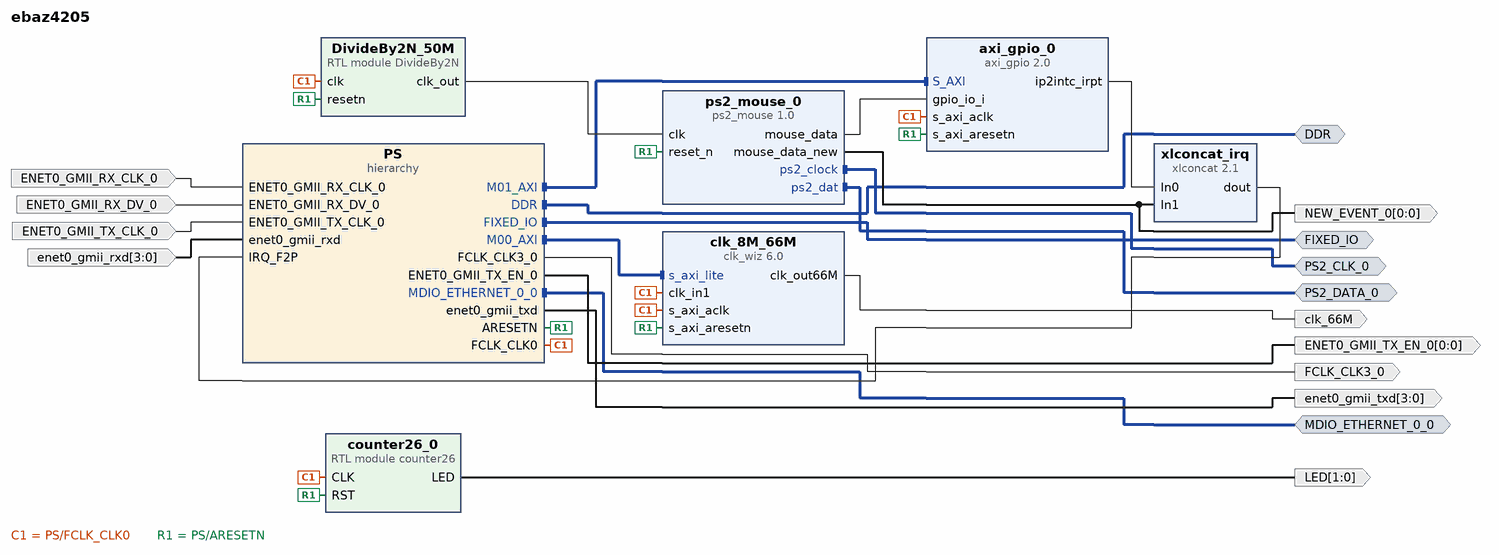
[diagram p0: block diagram of the top level]
# Vivado block design ebaz4205, xc7z010clg400-1, Vivado 2021.2
create_bd_design ebaz4205

create_bd_intf_port -mode Master -vlnv xilinx.com:interface:ddrx_rtl:1.0 DDR
create_bd_intf_port -mode Master -vlnv xilinx.com:display_processing_system7:fixedio_rtl:1.0 FIXED_IO
create_bd_intf_port -mode Master -vlnv xilinx.com:interface:mdio_rtl:1.0 MDIO_ETHERNET_0_0
create_bd_intf_port -mode Master -vlnv xilinx.com:interface:gpio_rtl:1.0 PS2_CLK_0
create_bd_intf_port -mode Master -vlnv xilinx.com:interface:gpio_rtl:1.0 PS2_DATA_0
create_bd_port -dir I -type clk ENET0_GMII_RX_CLK_0
create_bd_port -dir I ENET0_GMII_RX_DV_0
create_bd_port -dir I -type clk ENET0_GMII_TX_CLK_0
create_bd_port -dir O -from 0 -to 0 ENET0_GMII_TX_EN_0
create_bd_port -dir O -from 1 -to 0 LED
create_bd_port -dir I -from 3 -to 0 enet0_gmii_rxd
create_bd_port -dir O -from 3 -to 0 enet0_gmii_txd
create_bd_port -dir O -type clk clk_66M
set_property -dict {CONFIG.FREQ_HZ 66666666} [get_bd_ports clk_66M]
create_bd_port -dir O -type clk FCLK_CLK3_0
set_property -dict {CONFIG.FREQ_HZ 25000000} [get_bd_ports FCLK_CLK3_0]
create_bd_port -dir O -from 0 -to 0 NEW_EVENT_0

create_bd_cell -type ip -vlnv xilinx.com:ip:clk_wiz:6.0 clk_8M_66M
set_property -dict [list \
  CONFIG.CLKIN1_JITTER_PS 100.0 \
  CONFIG.CLKOUT1_JITTER 142.508 \
  CONFIG.CLKOUT1_PHASE_ERROR 98.575 \
  CONFIG.CLKOUT1_REQUESTED_OUT_FREQ 66.66667 \
  CONFIG.CLKOUT2_JITTER 178.370 \
  CONFIG.CLKOUT2_PHASE_ERROR 164.985 \
  CONFIG.CLKOUT2_REQUESTED_OUT_FREQ 66.66667 \
  CONFIG.CLKOUT2_USED false \
  CONFIG.CLK_OUT1_PORT clk_out66M \
  CONFIG.CLK_OUT2_PORT clk_out66M \
  CONFIG.MMCM_CLKFBOUT_MULT_F 10.000 \
  CONFIG.MMCM_CLKIN1_PERIOD 10.000 \
  CONFIG.MMCM_CLKIN2_PERIOD 10.000 \
  CONFIG.MMCM_CLKOUT0_DIVIDE_F 15.000 \
  CONFIG.MMCM_CLKOUT1_DIVIDE 1 \
  CONFIG.NUM_OUT_CLKS 1 \
  CONFIG.PRIM_IN_FREQ 100.000 \
  CONFIG.USE_DYN_RECONFIG true \
] [get_bd_cells clk_8M_66M]
create_bd_cell -type hier PS
create_bd_cell -type module -reference DivideBy2N DivideBy2N_50M
set_property -dict {CONFIG.N 1 CONFIG.WIDTH 1} [get_bd_cells DivideBy2N_50M]
create_bd_cell -type module -reference counter26 counter26_0
set_property -dict {CONFIG.LED_COUNTER_1SEC 0x06FFFFFF CONFIG.THRESHOLD 0x00002710} [get_bd_cells counter26_0]
create_bd_cell -type ip -vlnv xilinx.com:ip:axi_gpio:2.0 axi_gpio_0
set_property -dict {CONFIG.C_ALL_INPUTS 1 CONFIG.C_INTERRUPT_PRESENT 1} [get_bd_cells axi_gpio_0]
create_bd_cell -type ip -vlnv xilinx.com:ip:xlconcat:2.1 xlconcat_irq
create_bd_cell -type ip -vlnv xilinx.com:user:ps2_mouse:1.0 ps2_mouse_0

# ---- hierarchy /PS ----
current_bd_instance /PS
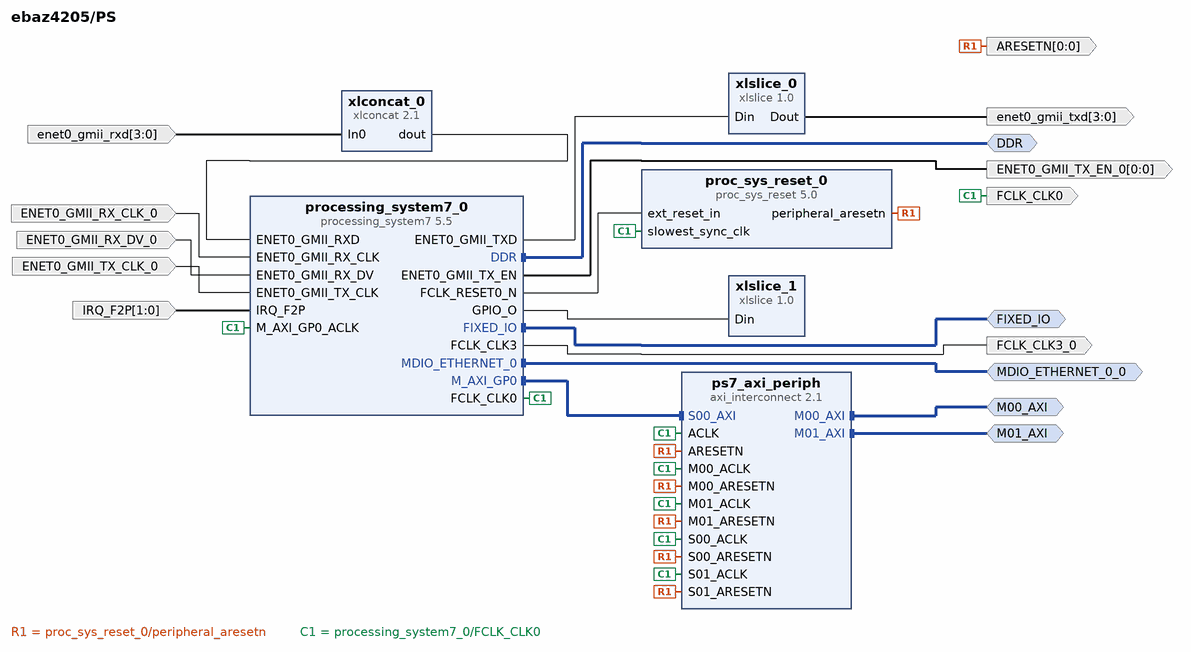
[diagram p1: block diagram inside /PS]
create_bd_intf_pin -mode Master -vlnv xilinx.com:interface:mdio_rtl:1.0 MDIO_ETHERNET_0_0
create_bd_intf_pin -mode Master -vlnv xilinx.com:interface:ddrx_rtl:1.0 DDR
create_bd_intf_pin -mode Master -vlnv xilinx.com:display_processing_system7:fixedio_rtl:1.0 FIXED_IO
create_bd_intf_pin -mode Master -vlnv xilinx.com:interface:aximm_rtl:1.0 M00_AXI
create_bd_intf_pin -mode Master -vlnv xilinx.com:interface:aximm_rtl:1.0 M01_AXI
create_bd_pin -dir O -from 0 -to 0 ENET0_GMII_TX_EN_0
create_bd_pin -dir I -type clk ENET0_GMII_RX_CLK_0
create_bd_pin -dir I ENET0_GMII_RX_DV_0
create_bd_pin -dir I -type clk ENET0_GMII_TX_CLK_0
create_bd_pin -dir O -type clk FCLK_CLK0
create_bd_pin -dir O -type clk FCLK_CLK3_0
create_bd_pin -dir O -from 3 -to 0 enet0_gmii_txd
create_bd_pin -dir O -from 0 -to 0 -type rst ARESETN
create_bd_pin -dir I -from 3 -to 0 enet0_gmii_rxd
create_bd_pin -dir I -from 1 -to 0 -type intr IRQ_F2P

create_bd_cell -type ip -vlnv xilinx.com:ip:xlslice:1.0 xlslice_0
set_property -dict {CONFIG.DIN_FROM 3 CONFIG.DIN_TO 0 CONFIG.DIN_WIDTH 8 CONFIG.DOUT_WIDTH 4} [get_bd_cells xlslice_0]
create_bd_cell -type ip -vlnv xilinx.com:ip:xlslice:1.0 xlslice_1
set_property -dict {CONFIG.DIN_FROM 1 CONFIG.DIN_WIDTH 64 CONFIG.DOUT_WIDTH 2} [get_bd_cells xlslice_1]
create_bd_cell -type ip -vlnv xilinx.com:ip:proc_sys_reset:5.0 proc_sys_reset_0
create_bd_cell -type ip -vlnv xilinx.com:ip:processing_system7:5.5 processing_system7_0
set_property -dict [list \
  CONFIG.PCW_ENET0_ENET0_IO EMIO \
  CONFIG.PCW_ENET0_GRP_MDIO_ENABLE 1 \
  CONFIG.PCW_ENET0_GRP_MDIO_IO EMIO \
  CONFIG.PCW_ENET0_PERIPHERAL_ENABLE 1 \
  CONFIG.PCW_ENET0_PERIPHERAL_FREQMHZ {100 Mbps} \
  CONFIG.PCW_ENET0_RESET_ENABLE 0 \
  CONFIG.PCW_ENET_RESET_ENABLE 1 \
  CONFIG.PCW_ENET_RESET_SELECT {Share reset pin} \
  CONFIG.PCW_EN_CLK3_PORT 1 \
  CONFIG.PCW_FCLK_CLK3_BUF TRUE \
  CONFIG.PCW_FPGA0_PERIPHERAL_FREQMHZ 100 \
  CONFIG.PCW_FPGA3_PERIPHERAL_FREQMHZ 25 \
  CONFIG.PCW_FPGA_FCLK3_ENABLE 1 \
  CONFIG.PCW_GPIO_EMIO_GPIO_ENABLE 1 \
  CONFIG.PCW_GPIO_EMIO_GPIO_IO 64 \
  CONFIG.PCW_GPIO_MIO_GPIO_ENABLE 1 \
  CONFIG.PCW_GPIO_MIO_GPIO_IO MIO \
  CONFIG.PCW_I2C_RESET_ENABLE 1 \
  CONFIG.PCW_IRQ_F2P_INTR 1 \
  CONFIG.PCW_NAND_NAND_IO {MIO 0 2.. 14} \
  CONFIG.PCW_NAND_PERIPHERAL_ENABLE 1 \
  CONFIG.PCW_SD0_GRP_CD_ENABLE 1 \
  CONFIG.PCW_SD0_GRP_CD_IO {MIO 34} \
  CONFIG.PCW_SD0_GRP_WP_ENABLE 0 \
  CONFIG.PCW_SD0_PERIPHERAL_ENABLE 1 \
  CONFIG.PCW_SD0_SD0_IO {MIO 40 .. 45} \
  CONFIG.PCW_SDIO_PERIPHERAL_FREQMHZ 25 \
  CONFIG.PCW_UART1_PERIPHERAL_ENABLE 1 \
  CONFIG.PCW_UART1_UART1_IO {MIO 24 .. 25} \
  CONFIG.PCW_UART_PERIPHERAL_FREQMHZ 100 \
  CONFIG.PCW_UIPARAM_DDR_BUS_WIDTH {16 Bit} \
  CONFIG.PCW_UIPARAM_DDR_PARTNO {MT41K128M16 JT-125} \
  CONFIG.PCW_USB_RESET_ENABLE 1 \
  CONFIG.PCW_USE_FABRIC_INTERRUPT 1 \
] [get_bd_cells processing_system7_0]
# 213 more settings of processing_system7_0 are not shown: defaults, MIO pin electricals, DDR timing, and values the tool derives
create_bd_cell -type ip -vlnv xilinx.com:ip:xlconcat:2.1 xlconcat_0
set_property -dict {CONFIG.IN0_WIDTH 4 CONFIG.IN1_WIDTH 4 CONFIG.NUM_PORTS 2} [get_bd_cells xlconcat_0]
create_bd_cell -type ip -vlnv xilinx.com:ip:axi_interconnect:2.1 ps7_axi_periph
set_property -dict {CONFIG.NUM_MI 2 CONFIG.NUM_SI 2} [get_bd_cells ps7_axi_periph]

# ---- connections ----

current_bd_instance /PS
connect_bd_intf_net [get_bd_intf_pins M01_AXI] [get_bd_intf_pins ps7_axi_periph/M01_AXI]
connect_bd_intf_net [get_bd_intf_pins DDR] [get_bd_intf_pins processing_system7_0/DDR]
connect_bd_intf_net [get_bd_intf_pins FIXED_IO] [get_bd_intf_pins processing_system7_0/FIXED_IO]
connect_bd_intf_net [get_bd_intf_pins MDIO_ETHERNET_0_0] [get_bd_intf_pins processing_system7_0/MDIO_ETHERNET_0]
connect_bd_intf_net [get_bd_intf_pins processing_system7_0/M_AXI_GP0] [get_bd_intf_pins ps7_axi_periph/S00_AXI]
connect_bd_intf_net [get_bd_intf_pins M00_AXI] [get_bd_intf_pins ps7_axi_periph/M00_AXI]
connect_bd_net -net ENET0_GMII_RX_CLK_0_1 [get_bd_pins ENET0_GMII_RX_CLK_0] [get_bd_pins processing_system7_0/ENET0_GMII_RX_CLK]
connect_bd_net -net ENET0_GMII_RX_DV_0_1 [get_bd_pins ENET0_GMII_RX_DV_0] [get_bd_pins processing_system7_0/ENET0_GMII_RX_DV]
connect_bd_net -net ENET0_GMII_TX_CLK_0_1 [get_bd_pins ENET0_GMII_TX_CLK_0] [get_bd_pins processing_system7_0/ENET0_GMII_TX_CLK]
connect_bd_net [get_bd_pins IRQ_F2P] [get_bd_pins processing_system7_0/IRQ_F2P]
connect_bd_net -net In0_0_1 [get_bd_pins enet0_gmii_rxd] [get_bd_pins xlconcat_0/In0]
connect_bd_net [get_bd_pins proc_sys_reset_0/peripheral_aresetn] \
  [get_bd_pins ARESETN] [get_bd_pins ps7_axi_periph/S00_ARESETN] [get_bd_pins ps7_axi_periph/M00_ARESETN] \
  [get_bd_pins ps7_axi_periph/ARESETN] [get_bd_pins ps7_axi_periph/S01_ARESETN] [get_bd_pins ps7_axi_periph/M01_ARESETN]
connect_bd_net [get_bd_pins processing_system7_0/ENET0_GMII_TXD] [get_bd_pins xlslice_0/Din]
connect_bd_net [get_bd_pins processing_system7_0/ENET0_GMII_TX_EN] [get_bd_pins ENET0_GMII_TX_EN_0]
connect_bd_net [get_bd_pins processing_system7_0/FCLK_CLK0] \
  [get_bd_pins FCLK_CLK0] [get_bd_pins proc_sys_reset_0/slowest_sync_clk] [get_bd_pins ps7_axi_periph/ACLK] \
  [get_bd_pins ps7_axi_periph/S00_ACLK] [get_bd_pins ps7_axi_periph/M00_ACLK] \
  [get_bd_pins processing_system7_0/M_AXI_GP0_ACLK] [get_bd_pins ps7_axi_periph/S01_ACLK] \
  [get_bd_pins ps7_axi_periph/M01_ACLK]
connect_bd_net [get_bd_pins processing_system7_0/FCLK_CLK3] [get_bd_pins FCLK_CLK3_0]
connect_bd_net [get_bd_pins processing_system7_0/FCLK_RESET0_N] [get_bd_pins proc_sys_reset_0/ext_reset_in]
connect_bd_net [get_bd_pins processing_system7_0/GPIO_O] [get_bd_pins xlslice_1/Din]
connect_bd_net [get_bd_pins xlconcat_0/dout] [get_bd_pins processing_system7_0/ENET0_GMII_RXD]
connect_bd_net [get_bd_pins xlslice_0/Dout] [get_bd_pins enet0_gmii_txd]

current_bd_instance /
connect_bd_intf_net [get_bd_intf_pins axi_gpio_0/S_AXI] [get_bd_intf_pins PS/M01_AXI]
connect_bd_intf_net -intf_net processing_system7_0_DDR [get_bd_intf_ports DDR] [get_bd_intf_pins PS/DDR]
connect_bd_intf_net -intf_net processing_system7_0_FIXED_IO [get_bd_intf_ports FIXED_IO] [get_bd_intf_pins PS/FIXED_IO]
connect_bd_intf_net -intf_net processing_system7_0_MDIO_ETHERNET_0 [get_bd_intf_ports MDIO_ETHERNET_0_0] [get_bd_intf_pins PS/MDIO_ETHERNET_0_0]
connect_bd_intf_net [get_bd_intf_ports PS2_CLK_0] [get_bd_intf_pins ps2_mouse_0/ps2_clock]
connect_bd_intf_net [get_bd_intf_ports PS2_DATA_0] [get_bd_intf_pins ps2_mouse_0/ps2_dat]
connect_bd_intf_net [get_bd_intf_pins PS/M00_AXI] [get_bd_intf_pins clk_8M_66M/s_axi_lite]
connect_bd_net -net DivideBy2N_0_clk_out [get_bd_pins DivideBy2N_50M/clk_out] [get_bd_pins ps2_mouse_0/clk]
connect_bd_net -net ENET0_GMII_RX_CLK_0_1 [get_bd_ports ENET0_GMII_RX_CLK_0] [get_bd_pins PS/ENET0_GMII_RX_CLK_0]
connect_bd_net -net ENET0_GMII_RX_DV_0_1 [get_bd_ports ENET0_GMII_RX_DV_0] [get_bd_pins PS/ENET0_GMII_RX_DV_0]
connect_bd_net -net ENET0_GMII_TX_CLK_0_1 [get_bd_ports ENET0_GMII_TX_CLK_0] [get_bd_pins PS/ENET0_GMII_TX_CLK_0]
connect_bd_net -net In0_0_1 [get_bd_ports enet0_gmii_rxd] [get_bd_pins PS/enet0_gmii_rxd]
connect_bd_net [get_bd_pins PS/FCLK_CLK0] \
  [get_bd_pins clk_8M_66M/clk_in1] [get_bd_pins clk_8M_66M/s_axi_aclk] [get_bd_pins DivideBy2N_50M/clk] \
  [get_bd_pins counter26_0/CLK] [get_bd_pins axi_gpio_0/s_axi_aclk]
connect_bd_net [get_bd_pins PS/FCLK_CLK3_0] [get_bd_ports FCLK_CLK3_0]
connect_bd_net [get_bd_pins axi_gpio_0/ip2intc_irpt] [get_bd_pins xlconcat_irq/In0]
connect_bd_net [get_bd_pins clk_8M_66M/clk_out66M] [get_bd_ports clk_66M]
connect_bd_net [get_bd_pins counter26_0/LED] [get_bd_ports LED]
connect_bd_net -net proc_sys_reset_0_peripheral_aresetn [get_bd_pins PS/ARESETN] \
  [get_bd_pins clk_8M_66M/s_axi_aresetn] [get_bd_pins DivideBy2N_50M/resetn] [get_bd_pins counter26_0/RST] \
  [get_bd_pins axi_gpio_0/s_axi_aresetn] [get_bd_pins ps2_mouse_0/reset_n]
connect_bd_net -net processing_system7_0_ENET0_GMII_TX_EN [get_bd_pins PS/ENET0_GMII_TX_EN_0] [get_bd_ports ENET0_GMII_TX_EN_0]
connect_bd_net [get_bd_pins ps2_mouse_0/mouse_data] [get_bd_pins axi_gpio_0/gpio_io_i]
connect_bd_net [get_bd_pins ps2_mouse_0/mouse_data_new] [get_bd_ports NEW_EVENT_0] [get_bd_pins xlconcat_irq/In1]
connect_bd_net [get_bd_pins xlconcat_irq/dout] [get_bd_pins PS/IRQ_F2P]
connect_bd_net -net xlslice_0_Dout [get_bd_pins PS/enet0_gmii_txd] [get_bd_ports enet0_gmii_txd]

# ---- address map ----
assign_bd_address -offset 0x41200000 -range 64K -target_address_space [get_bd_addr_spaces PS/processing_system7_0/Data] [get_bd_addr_segs axi_gpio_0/S_AXI/Reg]
assign_bd_address -offset 0x43C00000 -range 64K -target_address_space [get_bd_addr_spaces PS/processing_system7_0/Data] [get_bd_addr_segs clk_8M_66M/s_axi_lite/Reg]

set_property USER_COMMENTS.comment_0 {PS groups:
- Programmable System(CPU)
- Reset
- AXI control
- Ethernet} [current_bd_design]
set_property USER_COMMENTS.comment_1 {clk_66M frequency can be 
changed via AXI (default 66,67 MHz} [current_bd_design]

validate_bd_design
save_bd_design
